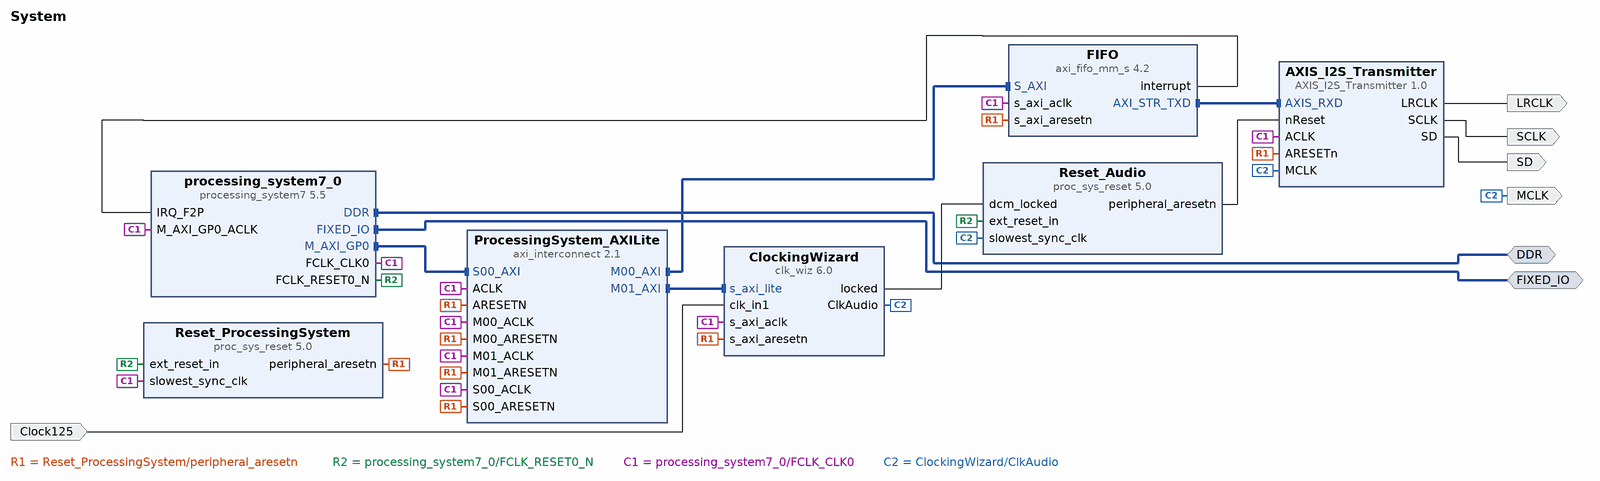
[diagram p0: block diagram of the top level]
# Vivado block design System, xc7z007sclg225-1, Vivado 2020.2
create_bd_design System

create_bd_intf_port -mode Master -vlnv xilinx.com:interface:ddrx_rtl:1.0 DDR
create_bd_intf_port -mode Master -vlnv xilinx.com:display_processing_system7:fixedio_rtl:1.0 FIXED_IO
create_bd_port -dir I -type clk Clock125
set_property -dict {CONFIG.FREQ_HZ 125000000} [get_bd_ports Clock125]
create_bd_port -dir O LRCLK
create_bd_port -dir O SCLK
create_bd_port -dir O SD
create_bd_port -dir O -type clk MCLK
set_property -dict {CONFIG.FREQ_HZ 12288013} [get_bd_ports MCLK]

create_bd_cell -type ip -vlnv www.Kampis-Elektroecke.com:Kampis-Elektroecke:AXIS_I2S_Transmitter:1.0 AXIS_I2S_Transmitter
set_property -dict {CONFIG.RATIO 8} [get_bd_cells AXIS_I2S_Transmitter]
create_bd_cell -type ip -vlnv xilinx.com:ip:axi_interconnect:2.1 ProcessingSystem_AXILite
set_property -dict {CONFIG.NUM_MI 2} [get_bd_cells ProcessingSystem_AXILite]
create_bd_cell -type ip -vlnv xilinx.com:ip:axi_fifo_mm_s:4.2 FIFO
set_property -dict {CONFIG.C_TX_FIFO_PE_THRESHOLD 5 CONFIG.C_USE_RX_DATA 0 CONFIG.C_USE_TX_CTRL 0} [get_bd_cells FIFO]
create_bd_cell -type ip -vlnv xilinx.com:ip:proc_sys_reset:5.0 Reset_ProcessingSystem
create_bd_cell -type ip -vlnv xilinx.com:ip:processing_system7:5.5 processing_system7_0
set_property -dict [list \
  CONFIG.PCW_APU_PERIPHERAL_FREQMHZ 666.666666 \
  CONFIG.PCW_DM_WIDTH 2 \
  CONFIG.PCW_DQS_WIDTH 2 \
  CONFIG.PCW_DQ_WIDTH 16 \
  CONFIG.PCW_ENET0_PERIPHERAL_ENABLE 0 \
  CONFIG.PCW_EN_CLK1_PORT 1 \
  CONFIG.PCW_FCLK_CLK1_BUF TRUE \
  CONFIG.PCW_FPGA0_PERIPHERAL_FREQMHZ 50 \
  CONFIG.PCW_FPGA1_PERIPHERAL_FREQMHZ 100 \
  CONFIG.PCW_FPGA_FCLK1_ENABLE 1 \
  CONFIG.PCW_GPIO_EMIO_GPIO_ENABLE 1 \
  CONFIG.PCW_GPIO_EMIO_GPIO_IO 16 \
  CONFIG.PCW_GPIO_EMIO_GPIO_WIDTH 16 \
  CONFIG.PCW_GPIO_MIO_GPIO_ENABLE 1 \
  CONFIG.PCW_GPIO_MIO_GPIO_IO MIO \
  CONFIG.PCW_I2C0_I2C0_IO EMIO \
  CONFIG.PCW_I2C0_PERIPHERAL_ENABLE 1 \
  CONFIG.PCW_I2C_PERIPHERAL_FREQMHZ 111.111115 \
  CONFIG.PCW_I2C_RESET_ENABLE 1 \
  CONFIG.PCW_I2C_RESET_SELECT {Share reset pin} \
  CONFIG.PCW_IRQ_F2P_INTR 1 \
  CONFIG.PCW_MIO_PRIMITIVE 32 \
  CONFIG.PCW_PRESET_BANK1_VOLTAGE {LVCMOS 3.3V} \
  CONFIG.PCW_QSPI_GRP_FBCLK_ENABLE 1 \
  CONFIG.PCW_QSPI_GRP_FBCLK_IO {MIO 8} \
  CONFIG.PCW_QSPI_GRP_SINGLE_SS_ENABLE 1 \
  CONFIG.PCW_QSPI_GRP_SINGLE_SS_IO {MIO 1 .. 6} \
  CONFIG.PCW_QSPI_PERIPHERAL_ENABLE 1 \
  CONFIG.PCW_QSPI_QSPI_IO {MIO 1 .. 6} \
  CONFIG.PCW_SD0_PERIPHERAL_ENABLE 1 \
  CONFIG.PCW_SD0_SD0_IO EMIO \
  CONFIG.PCW_SD1_PERIPHERAL_ENABLE 1 \
  CONFIG.PCW_SD1_SD1_IO {MIO 10 .. 15} \
  CONFIG.PCW_SDIO_PERIPHERAL_FREQMHZ 25 \
  CONFIG.PCW_SINGLE_QSPI_DATA_MODE x4 \
  CONFIG.PCW_UART0_GRP_FULL_ENABLE 1 \
  CONFIG.PCW_UART0_GRP_FULL_IO EMIO \
  CONFIG.PCW_UART0_PERIPHERAL_ENABLE 1 \
  CONFIG.PCW_UART0_UART0_IO EMIO \
  CONFIG.PCW_UART1_PERIPHERAL_ENABLE 1 \
  CONFIG.PCW_UART1_UART1_IO {MIO 48 .. 49} \
  CONFIG.PCW_UART_PERIPHERAL_FREQMHZ 100 \
  CONFIG.PCW_UIPARAM_DDR_BUS_WIDTH {16 Bit} \
  CONFIG.PCW_UIPARAM_DDR_FREQ_MHZ 533.333333 \
  CONFIG.PCW_UIPARAM_DDR_MEMORY_TYPE {DDR 3 (Low Voltage)} \
  CONFIG.PCW_UIPARAM_DDR_PARTNO {MT41K256M16 RE-125} \
  CONFIG.PCW_USB0_PERIPHERAL_ENABLE 1 \
  CONFIG.PCW_USB0_RESET_ENABLE 1 \
  CONFIG.PCW_USB0_RESET_IO {MIO 7} \
  CONFIG.PCW_USB0_USB0_IO {MIO 28 .. 39} \
  CONFIG.PCW_USB_RESET_ENABLE 1 \
  CONFIG.PCW_USB_RESET_SELECT {Share reset pin} \
  CONFIG.PCW_USE_FABRIC_INTERRUPT 1 \
] [get_bd_cells processing_system7_0]
# 318 more settings of processing_system7_0 are not shown: defaults, MIO pin electricals, DDR timing, and values the tool derives
create_bd_cell -type ip -vlnv xilinx.com:ip:proc_sys_reset:5.0 Reset_Audio
create_bd_cell -type ip -vlnv xilinx.com:ip:clk_wiz:6.0 ClockingWizard
set_property -dict [list \
  CONFIG.CLKIN1_JITTER_PS 80.0 \
  CONFIG.CLKOUT1_DRIVES BUFG \
  CONFIG.CLKOUT1_JITTER 473.813 \
  CONFIG.CLKOUT1_PHASE_ERROR 351.816 \
  CONFIG.CLKOUT1_REQUESTED_OUT_FREQ 12.288 \
  CONFIG.CLKOUT1_USED true \
  CONFIG.CLKOUT2_DRIVES BUFG \
  CONFIG.CLKOUT3_DRIVES BUFG \
  CONFIG.CLKOUT4_DRIVES BUFG \
  CONFIG.CLKOUT5_DRIVES BUFG \
  CONFIG.CLKOUT6_DRIVES BUFG \
  CONFIG.CLKOUT7_DRIVES BUFG \
  CONFIG.CLK_OUT1_PORT ClkAudio \
  CONFIG.FEEDBACK_SOURCE FDBK_AUTO \
  CONFIG.MMCM_BANDWIDTH OPTIMIZED \
  CONFIG.MMCM_CLKFBOUT_MULT_F 42.750 \
  CONFIG.MMCM_CLKIN1_PERIOD 8.000 \
  CONFIG.MMCM_CLKIN2_PERIOD 10.000 \
  CONFIG.MMCM_CLKOUT0_DIVIDE_F 62.125 \
  CONFIG.MMCM_COMPENSATION ZHOLD \
  CONFIG.MMCM_DIVCLK_DIVIDE 7 \
  CONFIG.PRIMITIVE MMCM \
  CONFIG.RESET_PORT reset \
  CONFIG.RESET_TYPE ACTIVE_HIGH \
  CONFIG.USE_DYN_RECONFIG true \
  CONFIG.USE_RESET true \
] [get_bd_cells ClockingWizard]

# ---- connections ----

connect_bd_intf_net [get_bd_intf_pins FIFO/AXI_STR_TXD] [get_bd_intf_pins AXIS_I2S_Transmitter/AXIS_RXD]
connect_bd_intf_net [get_bd_intf_ports DDR] [get_bd_intf_pins processing_system7_0/DDR]
connect_bd_intf_net [get_bd_intf_pins ProcessingSystem_AXILite/M00_AXI] [get_bd_intf_pins FIFO/S_AXI]
connect_bd_intf_net [get_bd_intf_pins ProcessingSystem_AXILite/M01_AXI] [get_bd_intf_pins ClockingWizard/s_axi_lite]
connect_bd_intf_net [get_bd_intf_pins processing_system7_0/M_AXI_GP0] [get_bd_intf_pins ProcessingSystem_AXILite/S00_AXI]
connect_bd_intf_net [get_bd_intf_ports FIXED_IO] [get_bd_intf_pins processing_system7_0/FIXED_IO]
connect_bd_net -net AXIS_I2S_Transmitter_0_LRCLK [get_bd_pins AXIS_I2S_Transmitter/LRCLK] [get_bd_ports LRCLK]
connect_bd_net -net AXIS_I2S_Transmitter_0_SCLK [get_bd_pins AXIS_I2S_Transmitter/SCLK] [get_bd_ports SCLK]
connect_bd_net -net AXIS_I2S_Transmitter_0_SD [get_bd_pins AXIS_I2S_Transmitter/SD] [get_bd_ports SD]
connect_bd_net [get_bd_pins Reset_ProcessingSystem/peripheral_aresetn] \
  [get_bd_pins AXIS_I2S_Transmitter/ARESETn] [get_bd_pins ProcessingSystem_AXILite/ARESETN] \
  [get_bd_pins ProcessingSystem_AXILite/S00_ARESETN] [get_bd_pins ProcessingSystem_AXILite/M00_ARESETN] \
  [get_bd_pins ProcessingSystem_AXILite/M01_ARESETN] [get_bd_pins FIFO/s_axi_aresetn] \
  [get_bd_pins ClockingWizard/s_axi_aresetn]
connect_bd_net [get_bd_pins Reset_Audio/peripheral_aresetn] [get_bd_pins AXIS_I2S_Transmitter/nReset]
connect_bd_net -net ProcessingSystem_FCLK_RESET0_N [get_bd_pins processing_system7_0/FCLK_RESET0_N] \
  [get_bd_pins Reset_Audio/ext_reset_in] [get_bd_pins Reset_ProcessingSystem/ext_reset_in]
connect_bd_net [get_bd_pins FIFO/interrupt] [get_bd_pins processing_system7_0/IRQ_F2P]
connect_bd_net -net ProcessingSystem_FCLK_CLK0 [get_bd_pins processing_system7_0/FCLK_CLK0] \
  [get_bd_pins AXIS_I2S_Transmitter/ACLK] [get_bd_pins ProcessingSystem_AXILite/ACLK] \
  [get_bd_pins ProcessingSystem_AXILite/S00_ACLK] [get_bd_pins ProcessingSystem_AXILite/M00_ACLK] \
  [get_bd_pins ProcessingSystem_AXILite/M01_ACLK] [get_bd_pins FIFO/s_axi_aclk] \
  [get_bd_pins Reset_ProcessingSystem/slowest_sync_clk] [get_bd_pins processing_system7_0/M_AXI_GP0_ACLK] \
  [get_bd_pins ClockingWizard/s_axi_aclk]
connect_bd_net [get_bd_pins ClockingWizard/ClkAudio] \
  [get_bd_ports MCLK] [get_bd_pins AXIS_I2S_Transmitter/MCLK] [get_bd_pins Reset_Audio/slowest_sync_clk]
connect_bd_net [get_bd_pins ClockingWizard/locked] [get_bd_pins Reset_Audio/dcm_locked]
connect_bd_net -net clk_in1_0_1 [get_bd_ports Clock125] [get_bd_pins ClockingWizard/clk_in1]

# ---- address map ----
assign_bd_address -offset 0x43C00000 -range 64K -target_address_space [get_bd_addr_spaces processing_system7_0/Data] [get_bd_addr_segs ClockingWizard/s_axi_lite/Reg]
assign_bd_address -offset 0x43C10000 -range 64K -target_address_space [get_bd_addr_spaces processing_system7_0/Data] [get_bd_addr_segs FIFO/S_AXI/Mem0]

validate_bd_design
save_bd_design
